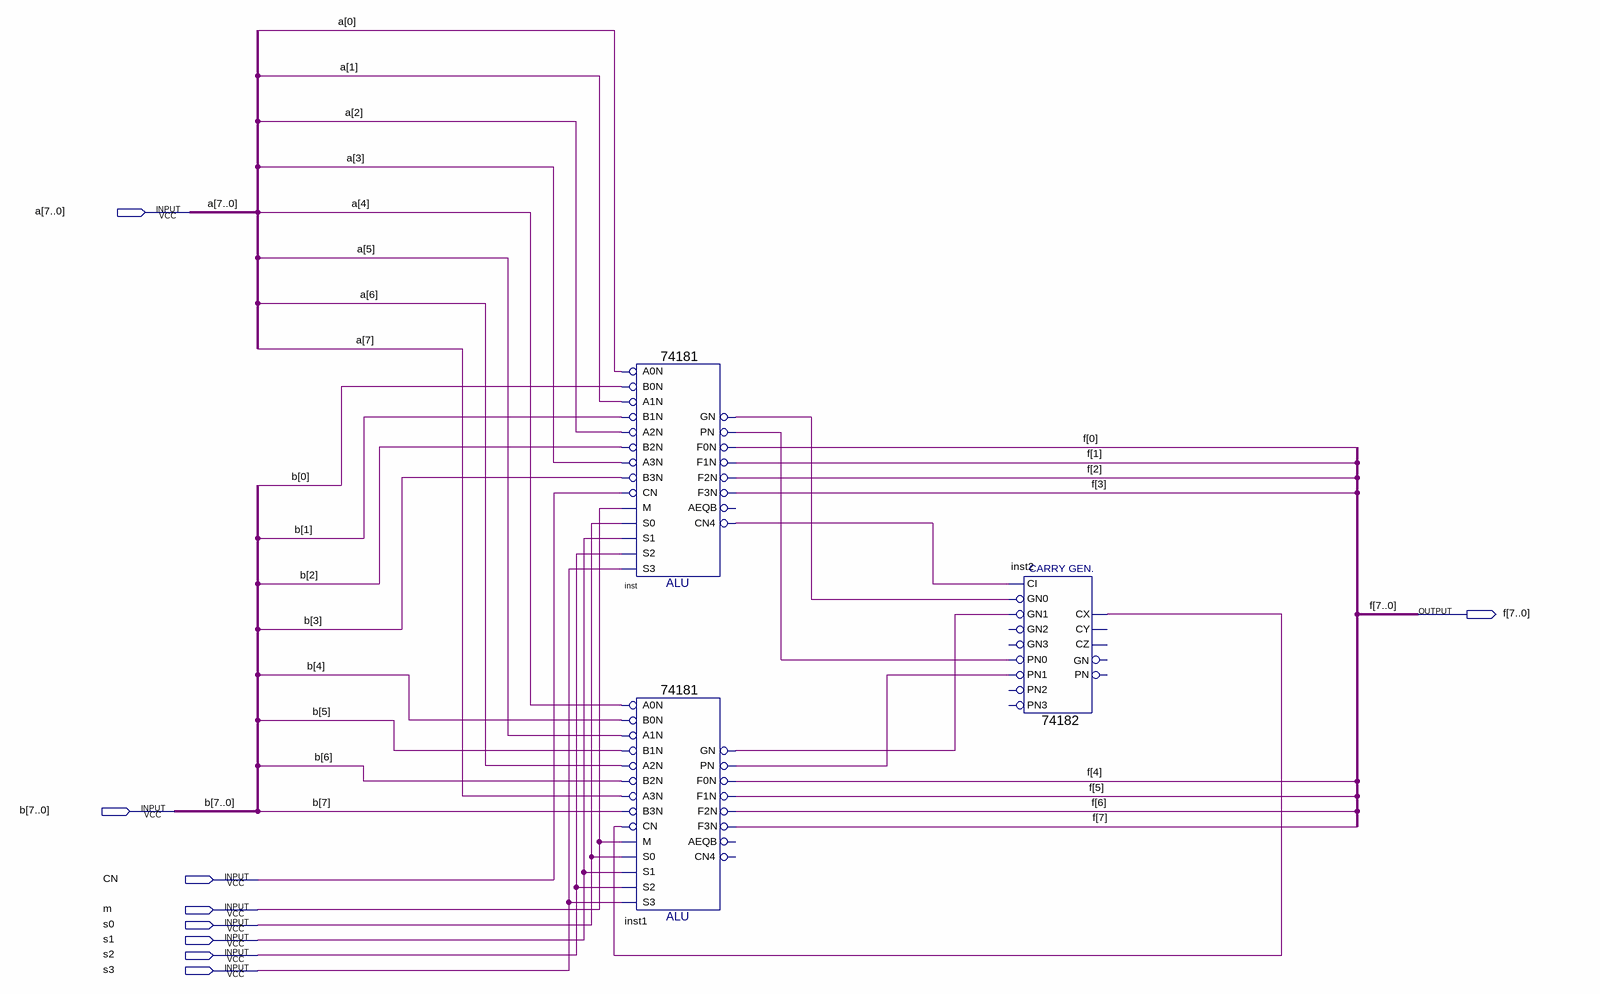
[diagram p0: schematic sheet]
// Quartus schematic ALU.bdf as structural Verilog: 3 symbols, 9 pins
module ALU (
  input  [7:0] a,
  input  [7:0] b,
  input  CN,
  input  m,
  input  s0,
  input  s1,
  input  s2,
  input  s3,
  output [7:0] f
);

  wire inst1_gn, inst1_pn, inst2_cx, inst_cn4, inst_gn, inst_pn;

  \74181  inst (
    .B0N(b[0]), .A0N(a[0]), .A1N(a[1]), .B1N(b[1]), .A3N(a[3]), .B2N(b[2]), .A2N(a[2]), .M(m), .CN(CN),
    .B3N(b[3]), .S2(s2), .S1(s1), .S0(s0), .S3(s3), .PN(inst_pn), .GN(inst_gn), .F3N(f[3]), .F1N(f[1]),
    .F0N(f[0]), .CN4(inst_cn4), .F2N(f[2]));  // open: AEQB
  \74181  inst1 (
    .B0N(b[4]), .A0N(a[4]), .A1N(a[5]), .B1N(b[5]), .A3N(a[7]), .B2N(b[6]), .A2N(a[6]), .M(m), .CN(inst2_cx),
    .B3N(b[7]), .S2(s2), .S1(s1), .S0(s0), .S3(s3), .PN(inst1_pn), .GN(inst1_gn), .F3N(f[7]), .F1N(f[5]),
    .F0N(f[4]), .F2N(f[6]));  // open: AEQB, CN4
  \74182  inst2 (
    .CI(inst_cn4), .PN1(inst1_pn), .PN0(inst_pn), .GN1(inst1_gn), .GN0(inst_gn), .CX(inst2_cx));  // open: PN2, GN2, GN3, PN3, CY, PN, CZ, GN
endmodule
